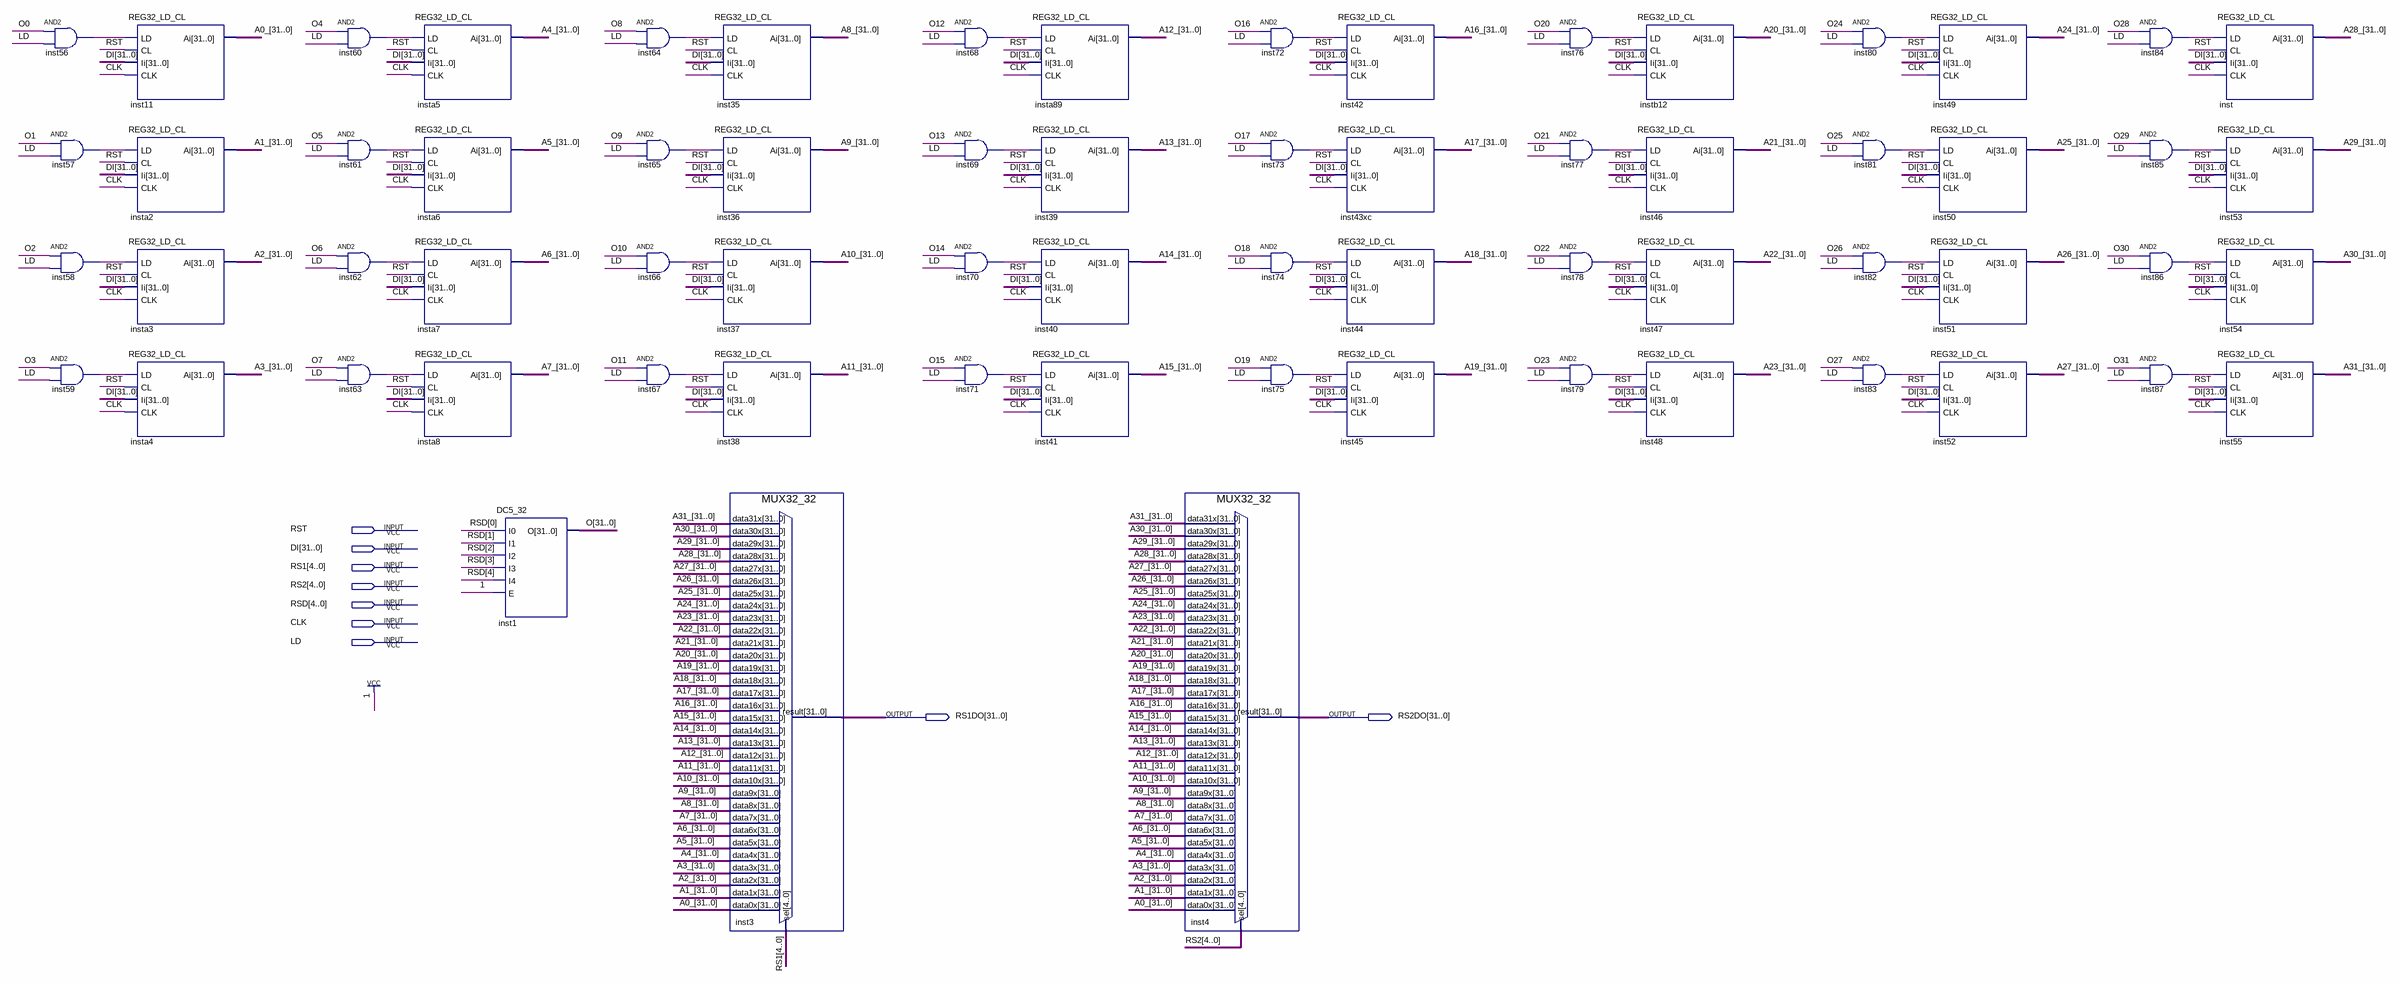
[diagram p0: schematic sheet]
// Quartus schematic 32xREG32_FILE.bdf as structural Verilog: 67 symbols, 9 pins
module \32xREG32_FILE  (
  input  RST,
  input  [31:0] DI,
  input  [4:0] RS1,
  input  [4:0] RS2,
  input  [4:0] RSD,
  input  CLK,
  input  LD,
  output [31:0] RS1DO,
  output [31:0] RS2DO
);

  wire inst56_out, inst57_out, inst58_out, inst59_out, inst60_out, inst61_out, inst62_out, inst63_out,
       inst64_out, inst65_out, inst66_out, inst67_out, inst68_out, inst69_out, inst70_out, inst71_out,
       inst72_out, inst73_out, inst74_out, inst75_out, inst76_out, inst77_out, inst78_out, inst79_out,
       inst80_out, inst81_out, inst82_out, inst83_out, inst84_out, inst85_out, inst86_out, inst87_out;
  wire [31:0] A0_, A1_, A2_, A3_, A4_, A5_, A6_, A7_, A8_, A9_, A10_, A11_, A12_, A13_, A14_, A15_, A16_,
       A17_, A18_, A19_, A20_, A21_, A22_, A23_, A24_, A25_, A26_, A27_, A28_, A29_, A30_, A31_, O;

  and inst56 (inst56_out, O[0], LD);
  and inst57 (inst57_out, O[1], LD);
  and inst58 (inst58_out, O[2], LD);
  and inst59 (inst59_out, O[3], LD);
  REG32_LD_CL inst11 (.LD(inst56_out), .CL(RST), .Ii(DI), .CLK(CLK), .Ai(A0_));
  REG32_LD_CL insta2 (.LD(inst57_out), .CL(RST), .Ii(DI), .CLK(CLK), .Ai(A1_));
  REG32_LD_CL insta3 (.LD(inst58_out), .CL(RST), .Ii(DI), .CLK(CLK), .Ai(A2_));
  REG32_LD_CL insta4 (.LD(inst59_out), .CL(RST), .Ii(DI), .CLK(CLK), .Ai(A3_));
  and inst60 (inst60_out, O[4], LD);
  and inst61 (inst61_out, O[5], LD);
  and inst62 (inst62_out, O[6], LD);
  and inst63 (inst63_out, O[7], LD);
  REG32_LD_CL insta5 (.LD(inst60_out), .CL(RST), .Ii(DI), .CLK(CLK), .Ai(A4_));
  REG32_LD_CL insta6 (.LD(inst61_out), .CL(RST), .Ii(DI), .CLK(CLK), .Ai(A5_));
  REG32_LD_CL insta7 (.LD(inst62_out), .CL(RST), .Ii(DI), .CLK(CLK), .Ai(A6_));
  REG32_LD_CL insta8 (.LD(inst63_out), .CL(RST), .Ii(DI), .CLK(CLK), .Ai(A7_));
  DC5_32 inst1 (.I0(RSD[0]), .I1(RSD[1]), .I2(RSD[2]), .I3(RSD[3]), .I4(RSD[4]), .E(1'b1), .O(O));
  and inst64 (inst64_out, O[8], LD);
  and inst65 (inst65_out, O[9], LD);
  and inst66 (inst66_out, O[10], LD);
  and inst67 (inst67_out, O[11], LD);
  REG32_LD_CL inst35 (.LD(inst64_out), .CL(RST), .Ii(DI), .CLK(CLK), .Ai(A8_));
  REG32_LD_CL inst36 (.LD(inst65_out), .CL(RST), .Ii(DI), .CLK(CLK), .Ai(A9_));
  REG32_LD_CL inst37 (.LD(inst66_out), .CL(RST), .Ii(DI), .CLK(CLK), .Ai(A10_));
  REG32_LD_CL inst38 (.LD(inst67_out), .CL(RST), .Ii(DI), .CLK(CLK), .Ai(A11_));
  MUX32_32 inst3 (
    .data31x(A31_), .data30x(A30_), .data29x(A29_), .data28x(A28_), .data27x(A27_), .data26x(A26_),
    .data25x(A25_), .data24x(A24_), .data23x(A23_), .data22x(A22_), .data21x(A21_), .data20x(A20_),
    .data19x(A19_), .data18x(A18_), .data17x(A17_), .data16x(A16_), .data15x(A15_), .data14x(A14_),
    .data13x(A13_), .data12x(A12_), .data11x(A11_), .data10x(A10_), .data9x(A9_), .data8x(A8_), .data7x(A7_),
    .data6x(A6_), .data5x(A5_), .data4x(A4_), .data3x(A3_), .data2x(A2_), .data1x(A1_), .data0x(A0_),
    .sel(RS1), .result(RS1DO));
  and inst68 (inst68_out, O[12], LD);
  and inst69 (inst69_out, O[13], LD);
  and inst70 (inst70_out, O[14], LD);
  and inst71 (inst71_out, O[15], LD);
  REG32_LD_CL insta89 (.LD(inst68_out), .CL(RST), .Ii(DI), .CLK(CLK), .Ai(A12_));
  REG32_LD_CL inst39 (.LD(inst69_out), .CL(RST), .Ii(DI), .CLK(CLK), .Ai(A13_));
  REG32_LD_CL inst40 (.LD(inst70_out), .CL(RST), .Ii(DI), .CLK(CLK), .Ai(A14_));
  REG32_LD_CL inst41 (.LD(inst71_out), .CL(RST), .Ii(DI), .CLK(CLK), .Ai(A15_));
  MUX32_32 inst4 (
    .data31x(A31_), .data30x(A30_), .data29x(A29_), .data28x(A28_), .data27x(A27_), .data26x(A26_),
    .data25x(A25_), .data24x(A24_), .data23x(A23_), .data22x(A22_), .data21x(A21_), .data20x(A20_),
    .data19x(A19_), .data18x(A18_), .data17x(A17_), .data16x(A16_), .data15x(A15_), .data14x(A14_),
    .data13x(A13_), .data12x(A12_), .data11x(A11_), .data10x(A10_), .data9x(A9_), .data8x(A8_), .data7x(A7_),
    .data6x(A6_), .data5x(A5_), .data4x(A4_), .data3x(A3_), .data2x(A2_), .data1x(A1_), .data0x(A0_),
    .sel(RS2), .result(RS2DO));
  and inst72 (inst72_out, O[16], LD);
  and inst73 (inst73_out, O[17], LD);
  and inst74 (inst74_out, O[18], LD);
  and inst75 (inst75_out, O[19], LD);
  REG32_LD_CL inst42 (.LD(inst72_out), .CL(RST), .Ii(DI), .CLK(CLK), .Ai(A16_));
  REG32_LD_CL inst43xc (.LD(inst73_out), .CL(RST), .Ii(DI), .CLK(CLK), .Ai(A17_));
  REG32_LD_CL inst44 (.LD(inst74_out), .CL(RST), .Ii(DI), .CLK(CLK), .Ai(A18_));
  REG32_LD_CL inst45 (.LD(inst75_out), .CL(RST), .Ii(DI), .CLK(CLK), .Ai(A19_));
  and inst76 (inst76_out, O[20], LD);
  and inst77 (inst77_out, O[21], LD);
  and inst78 (inst78_out, O[22], LD);
  and inst79 (inst79_out, O[23], LD);
  REG32_LD_CL instb12 (.LD(inst76_out), .CL(RST), .Ii(DI), .CLK(CLK), .Ai(A20_));
  REG32_LD_CL inst46 (.LD(inst77_out), .CL(RST), .Ii(DI), .CLK(CLK), .Ai(A21_));
  REG32_LD_CL inst47 (.LD(inst78_out), .CL(RST), .Ii(DI), .CLK(CLK), .Ai(A22_));
  REG32_LD_CL inst48 (.LD(inst79_out), .CL(RST), .Ii(DI), .CLK(CLK), .Ai(A23_));
  and inst80 (inst80_out, O[24], LD);
  and inst81 (inst81_out, O[25], LD);
  and inst82 (inst82_out, O[26], LD);
  and inst83 (inst83_out, O[27], LD);
  REG32_LD_CL inst49 (.LD(inst80_out), .CL(RST), .Ii(DI), .CLK(CLK), .Ai(A24_));
  REG32_LD_CL inst50 (.LD(inst81_out), .CL(RST), .Ii(DI), .CLK(CLK), .Ai(A25_));
  REG32_LD_CL inst51 (.LD(inst82_out), .CL(RST), .Ii(DI), .CLK(CLK), .Ai(A26_));
  REG32_LD_CL inst52 (.LD(inst83_out), .CL(RST), .Ii(DI), .CLK(CLK), .Ai(A27_));
  and inst84 (inst84_out, O[28], LD);
  and inst85 (inst85_out, O[29], LD);
  and inst86 (inst86_out, O[30], LD);
  and inst87 (inst87_out, O[31], LD);
  REG32_LD_CL inst (.LD(inst84_out), .CL(RST), .Ii(DI), .CLK(CLK), .Ai(A28_));
  REG32_LD_CL inst53 (.LD(inst85_out), .CL(RST), .Ii(DI), .CLK(CLK), .Ai(A29_));
  REG32_LD_CL inst54 (.LD(inst86_out), .CL(RST), .Ii(DI), .CLK(CLK), .Ai(A30_));
  REG32_LD_CL inst55 (.LD(inst87_out), .CL(RST), .Ii(DI), .CLK(CLK), .Ai(A31_));
endmodule
